# EAGLE design Pawn (EAGLE 8.3.1)
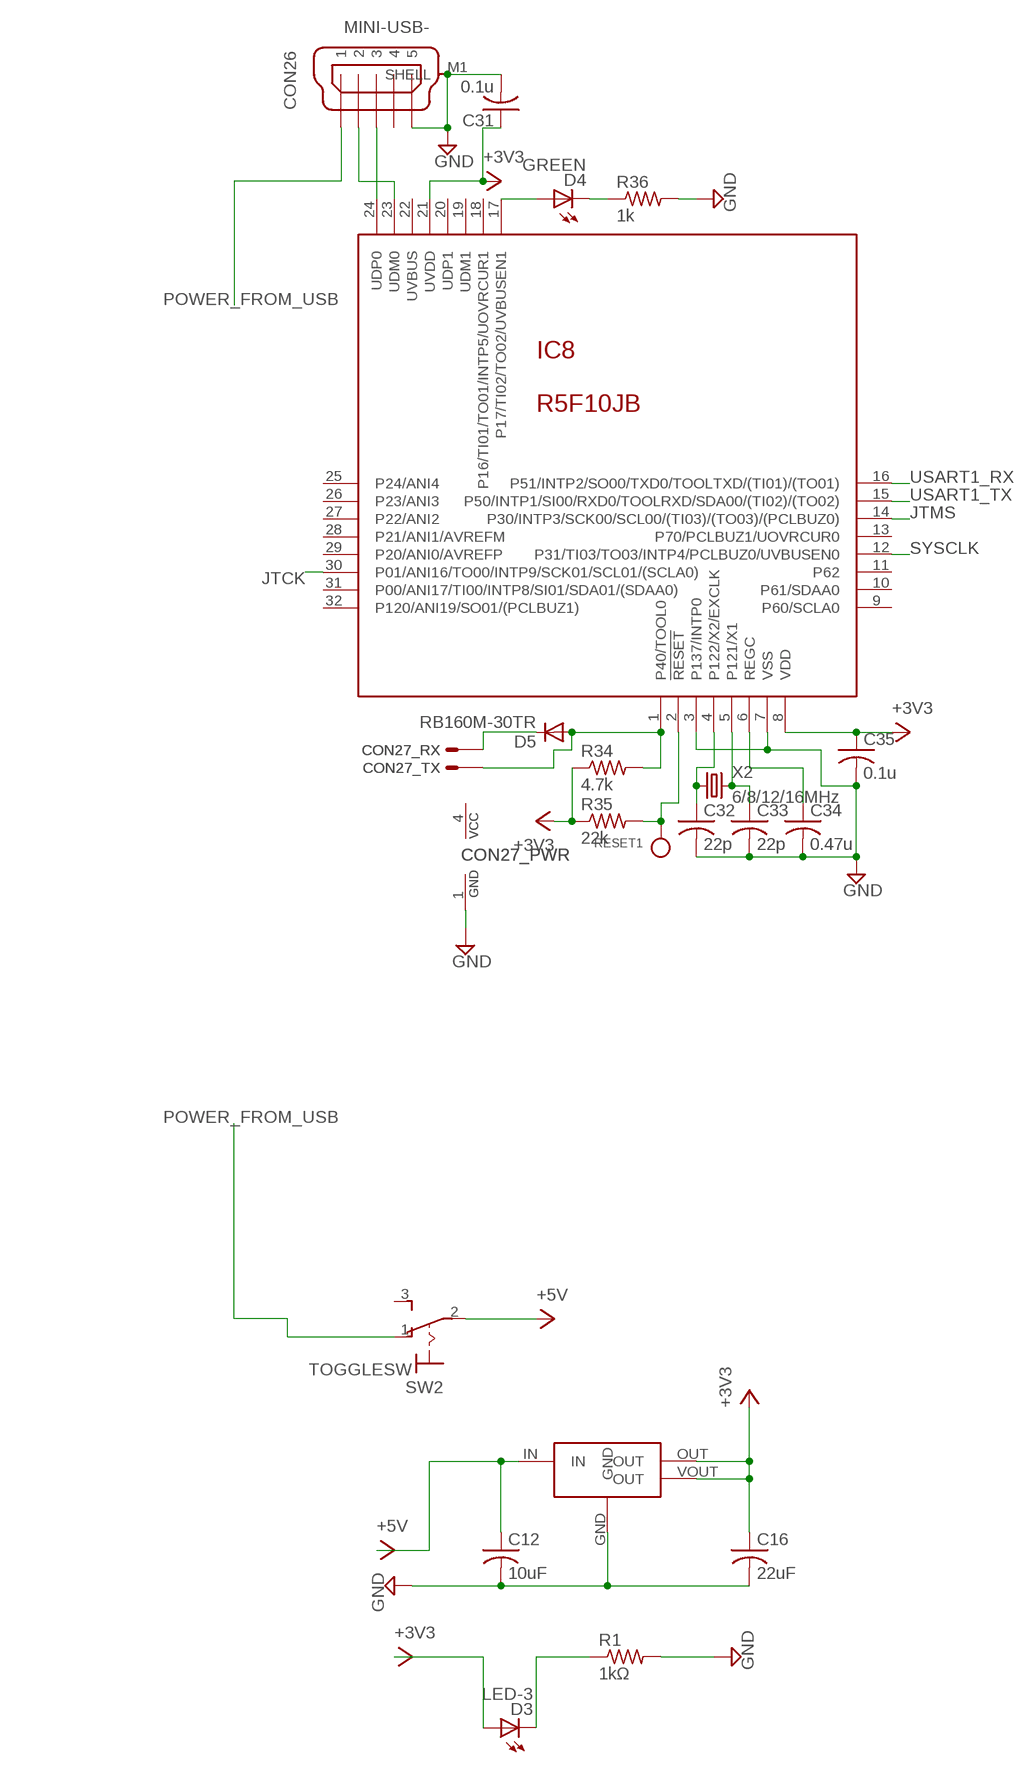
[diagram p0: schematic, sheet 1, part 1 of 2]
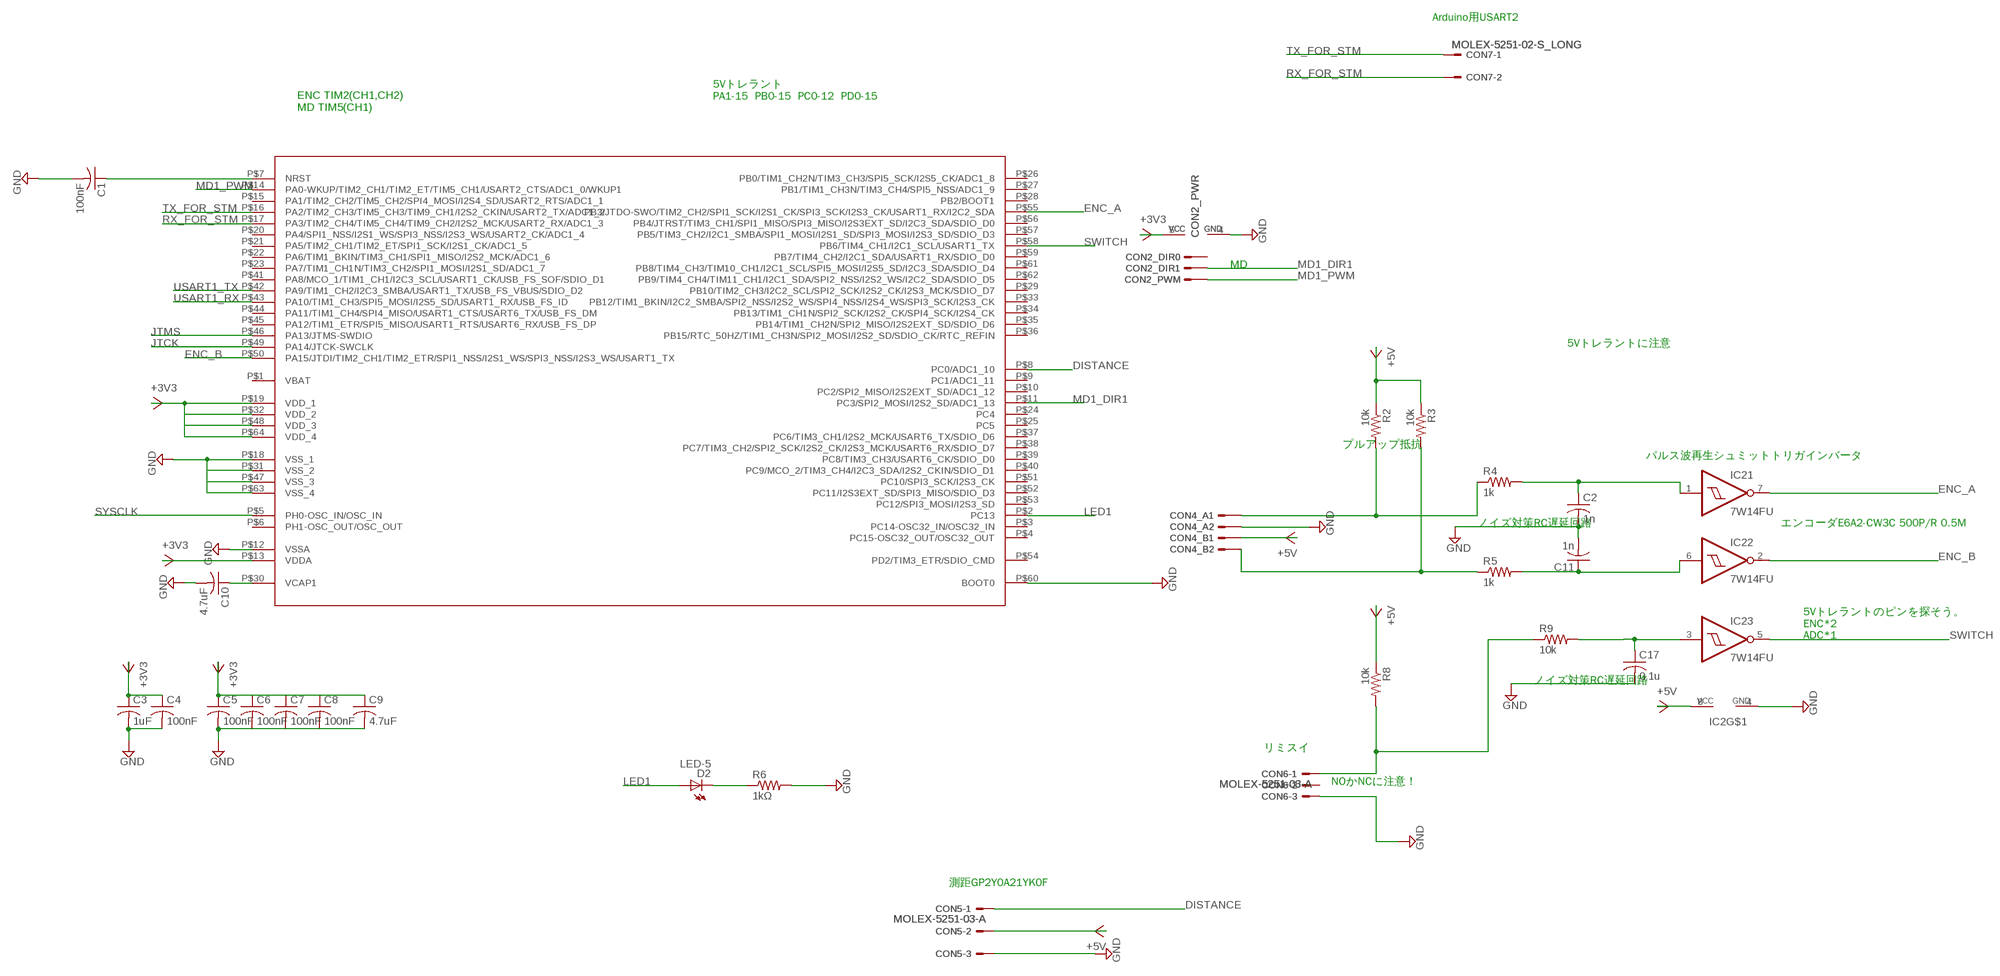
[diagram p1: schematic, sheet 1, part 2 of 2]

## Parts
C1  100nF  C-2012  [2012-C]
C2  1n  C-2012  [2012-C]
C3  1uF  C-2012  [2012-C]
C4  100nF  C-2012  [2012-C]
C5  100nF  C-2012  [2012-C]
C6  100nF  C-2012  [2012-C]
C7  100nF  C-2012  [2012-C]
C8  100nF  C-2012  [2012-C]
C9  4.7uF  C-2012  [2012-C]
C10  4.7uF  C-2012  [2012-C]
C11  1n  C-2012  [2012-C]
C12  10uF  C-2012  [2012-C]
C16  22uF  C-2012  [2012-C]
C17  0.1u  C-2012  [2012-C]
C31  0.1u  C-2012  [2012-C]
C32  22p  C-1608  [1608]
C33  22p  C-1608  [1608]
C34  0.47u  C-2012  [2012-C]
C35  0.1u  C-2012  [2012-C]
CON2  MTDRV-A  [5251-05-A]
CON4  D-3500-4  [D3500D-4-HORIZONTAL]
CON5  MOLEX-5251-03-A  [5251-03-A]
CON6  MOLEX-5251-03-A  [5251-03-A]
CON7  MOLEX-5251-02-S_LONG  [5251-02-S_LONG]
CON26  MINI-USB-  [UX60A-MB-5ST]
CON27  UART-S  [IL-G-04-S]
D2  LED-5  [LED5]
D3  LED-3  [LED3]
D4  GREEN  LED-3  [LED3]
D5  RB160M-30TR  DIODE-SMD3216  [D3216]
IC1  AZ1086H-3.3  [SOT223]
IC2  7W14FU  [MSOP8]
IC8  R5F10JB  [TQFP32-08]
R1  1kΩ  R-2012  [2012-R]
R2  10k  R-2012  [2012-R]
R3  10k  R-2012  [2012-R]
R4  1k  R-2012  [2012-R]
R5  1k  R-2012  [2012-R]
R6  1kΩ  R-2012  [2012-R]
R8  10k  R-2012  [2012-R]
R9  10k  R-2012  [2012-R]
R34  4.7k  R-2012  [2012-R]
R35  22k  R-2012  [2012-R]
R36  1k  R-2012  [2012-R]
RESET1  CHECK_PIN  [SLC-22-G]
SW2  TOGGLESW  [TOGGLESW]
U$1  STM32F411RET6  [ET-PCB-LQFP64]
X2  6/8/12/16MHz  CRYSTALHC49S  [HC49/S]

## Nets
+3V3: C3.1 C4.1 C5.1 C6.1 C7.1 C8.1 C9.1 C16.1 C31.1 C35.1 CON2.5(_PWR:VCC) D3.A IC1.OUT IC1.VOUT(OUT) IC8.8(VDD) IC8.21(UVDD) R34.1 R35.1 U$1.P$13(VDDA) U$1.P$19(VDD_1) U$1.P$32(VDD_2) U$1.P$48(VDD_3) U$1.P$64(VDD_4)
+5V: C12.1 CON4.B1 CON5.2 IC1.IN IC2.8(VCC) R2.1 R3.1 R8.1 SW2.2(P)
DISTANCE: CON5.1 U$1.P$8(PC0/ADC1_10)
ENC_A: IC2.7(1:Y) U$1.P$55(PB3/JTDO-SWO/TIM2_CH2/SPI1_SCK/I2S1_CK/SPI3_SCK/I2S3_CK/USART1_RX/I2C2_SDA)
ENC_B: IC2.2(2:Y) U$1.P$50(PA15/JTDI/TIM2_CH1/TIM2_ETR/SPI1_NSS/I2S1_WS/SPI3_NSS/I2S3_WS/USART1_TX)
GND: C1.2 C2.2 C3.2 C4.2 C5.2 C6.2 C7.2 C8.2 C9.2 C10.2 C11.2 C12.2 C16.2 C17.2 C31.2 C32.2 C33.2 C34.2 C35.2 CON2.4(_PWR:GND) CON4.A2 CON5.3 CON6.3 CON26.5 CON26.M1(SHELL) CON27.1(_PWR:GND) IC1.GND IC2.4(GND) IC8.3(P137/INTP0) IC8.7(VSS) R1.2 R6.2 R36.2 U$1.P$12(VSSA) U$1.P$18(VSS_1) U$1.P$31(VSS_2) U$1.P$47(VSS_3) U$1.P$60(BOOT0) U$1.P$63(VSS_4)
JTCK: IC8.30(P01/ANI16/TO00/INTP9/SCK01/SCL01/(SCLA0)) U$1.P$49(PA14/JTCK-SWCLK)
JTMS: IC8.14(P30/INTP3/SCK00/SCL00/(TI03)/(TO03)/(PCLBUZ0)) U$1.P$46(PA13/JTMS-SWDIO)
LED1: D2.A U$1.P$2(PC13)
MD1_DIR1: CON2.2(_DIR1:S) U$1.P$11(PC3/SPI2_MOSI/I2S2_SD/ADC1_13)
MD1_PWM: CON2.1(_PWM:S) U$1.P$14(PA0-WKUP/TIM2_CH1/TIM2_ET/TIM5_CH1/USART2_CTS/ADC1_0/WKUP1)
N$1: D2.K R6.1
N$3: C10.1 U$1.P$30(VCAP1)
N$5: CON4.A1 R2.2 R4.1
N$6: C2.1 IC2.1(1:A) R4.2
N$7: D3.K R1.1
N$8: C11.1 IC2.6(2:A) R5.2
N$9: CON4.B2 R3.2 R5.1
N$10: CON6.1 R8.2 R9.1
N$13: C17.1 IC2.3(3:A) R9.2
N$26: C1.1 U$1.P$7(NRST)
N$69: CON26.3 IC8.24(UDP0)
N$70: CON26.2 IC8.23(UDM0)
N$86: C32.1 IC8.4(P122/X2/EXCLK) X2.1
N$87: C33.1 IC8.5(P121/X1) X2.2
N$88: IC8.2(!RESET!) R35.2 RESET1.SIGNAL
N$89: C34.1 IC8.6(REGC)
N$90: CON27.3(_TX:S) D5.A IC8.1(P40/TOOL0) R34.2
N$91: CON27.2(_RX:S) D5.K(C)
N$102: D4.A IC8.17(P17/TI02/TO02/UVBUSEN1)
N$103: D4.K R36.1
POWER_FROM_USB: CON26.1 SW2.1(O)
RX_FOR_STM: CON7.2 U$1.P$17(PA3/TIM2_CH4/TIM5_CH4/TIM9_CH2/I2S2_MCK/USART2_RX/ADC1_3)
SWITCH: IC2.5(3:Y) U$1.P$58(PB6/TIM4_CH1/I2C1_SCL/USART1_TX)
SYSCLK: IC8.12(P31/TI03/TO03/INTP4/PCLBUZ0/UVBUSEN0) U$1.P$5(PH0-OSC_IN/OSC_IN)
TX_FOR_STM: CON7.1 U$1.P$16(PA2/TIM2_CH3/TIM5_CH3/TIM9_CH1/I2S2_CKIN/USART2_TX/ADC1_2)
USART1_RX: IC8.16(P51/INTP2/SO00/TXD0/TOOLTXD/(TI01)/(TO01)) U$1.P$43(PA10/TIM1_CH3/SPI5_MOSI/I2S5_SD/USART1_RX/USB_FS_ID)
USART1_TX: IC8.15(P50/INTP1/SI00/RXD0/TOOLRXD/SDA00/(TI02)/(TO02)) U$1.P$42(PA9/TIM1_CH2/I2C3_SMBA/USART1_TX/USB_FS_VBUS/SDIO_D2)
Unconnected: CON2.3(_DIR0:S) CON6.2 CON26.4 IC8.9(P60/SCLA0) IC8.10(P61/SDAA0) IC8.11(P62) IC8.13(P70/PCLBUZ1/UOVRCUR0) IC8.18(P16/TI01/TO01/INTP5/UOVRCUR1) IC8.19(UDM1) IC8.20(UDP1) IC8.22(UVBUS) IC8.25(P24/ANI4) IC8.26(P23/ANI3) IC8.27(P22/ANI2) IC8.28(P21/ANI1/AVREFM) IC8.29(P20/ANI0/AVREFP) IC8.31(P00/ANI17/TI00/INTP8/SI01/SDA01/(SDAA0)) IC8.32(P120/ANI19/SO01/(PCLBUZ1)) SW2.3(S) SW2.SHELL1(SHELL) SW2.SHELL2(SHELL) U$1.P$1(VBAT) U$1.P$3(PC14-OSC32_IN/OSC32_IN) U$1.P$4(PC15-OSC32_OUT/OSC32_OUT) U$1.P$6(PH1-OSC_OUT/OSC_OUT) U$1.P$9(PC1/ADC1_11) U$1.P$10(PC2/SPI2_MISO/I2S2EXT_SD/ADC1_12) U$1.P$15(PA1/TIM2_CH2/TIM5_CH2/SPI4_MOSI/I2S4_SD/USART2_RTS/ADC1_1) U$1.P$20(PA4/SPI1_NSS/I2S1_WS/SPI3_NSS/I2S3_WS/USART2_CK/ADC1_4) U$1.P$21(PA5/TIM2_CH1/TIM2_ET/SPI1_SCK/I2S1_CK/ADC1_5) U$1.P$22(PA6/TIM1_BKIN/TIM3_CH1/SPI1_MISO/I2S2_MCK/ADC1_6) U$1.P$23(PA7/TIM1_CH1N/TIM3_CH2/SPI1_MOSI/I2S1_SD/ADC1_7) U$1.P$24(PC4) U$1.P$25(PC5) U$1.P$26(PB0/TIM1_CH2N/TIM3_CH3/SPI5_SCK/I2S5_CK/ADC1_8) U$1.P$27(PB1/TIM1_CH3N/TIM3_CH4/SPI5_NSS/ADC1_9) U$1.P$28(PB2/BOOT1) U$1.P$29(PB10/TIM2_CH3/I2C2_SCL/SPI2_SCK/I2S2_CK/I2S3_MCK/SDIO_D7) U$1.P$33(PB12/TIM1_BKIN/I2C2_SMBA/SPI2_NSS/I2S2_WS/SPI4_NSS/I2S4_WS/SPI3_SCK/I2S3_CK) U$1.P$34(PB13/TIM1_CH1N/SPI2_SCK/I2S2_CK/SPI4_SCK/I2S4_CK) U$1.P$35(PB14/TIM1_CH2N/SPI2_MISO/I2S2EXT_SD/SDIO_D6) U$1.P$36(PB15/RTC_50HZ/TIM1_CH3N/SPI2_MOSI/I2S2_SD/SDIO_CK/RTC_REFIN) U$1.P$37(PC6/TIM3_CH1/I2S2_MCK/USART6_TX/SDIO_D6) U$1.P$38(PC7/TIM3_CH2/SPI2_SCK/I2S2_CK/I2S3_MCK/USART6_RX/SDIO_D7) U$1.P$39(PC8/TIM3_CH3/USART6_CK/SDIO_D0) U$1.P$40(PC9/MCO_2/TIM3_CH4/I2C3_SDA/I2S2_CKIN/SDIO_D1) U$1.P$41(PA8/MCO_1/TIM1_CH1/I2C3_SCL/USART1_CK/USB_FS_SOF/SDIO_D1) U$1.P$44(PA11/TIM1_CH4/SPI4_MISO/USART1_CTS/USART6_TX/USB_FS_DM) U$1.P$45(PA12/TIM1_ETR/SPI5_MISO/USART1_RTS/USART6_RX/USB_FS_DP) U$1.P$51(PC10/SPI3_SCK/I2S3_CK) U$1.P$52(PC11/I2S3EXT_SD/SPI3_MISO/SDIO_D3) U$1.P$53(PC12/SPI3_MOSI/I2S3_SD) U$1.P$54(PD2/TIM3_ETR/SDIO_CMD) U$1.P$56(PB4/JTRST/TIM3_CH1/SPI1_MISO/SPI3_MISO/I2S3EXT_SD/I2C3_SDA/SDIO_D0) U$1.P$57(PB5/TIM3_CH2/I2C1_SMBA/SPI1_MOSI/I2S1_SD/SPI3_MOSI/I2S3_SD/SDIO_D3) U$1.P$59(PB7/TIM4_CH2/I2C1_SDA/USART1_RX/SDIO_D0) U$1.P$61(PB8/TIM4_CH3/TIM10_CH1/I2C1_SCL/SPI5_MOSI/I2S5_SD/I2C3_SDA/SDIO_D4) U$1.P$62(PB9/TIM4_CH4/TIM11_CH1/I2C1_SDA/SPI2_NSS/I2S2_WS/I2C2_SDA/SDIO_D5)

## Notes on the sheet
- Arduino用USART2
- 5Vトレラント
  PA1-15  PB0-15  PC0-12  PD0-15
- ⑦
- ENC TIM2(CH1,CH2)
  MD TIM5(CH1)
- MD
- 5Vトレラントに注意
- プルアップ抵抗
- パルス波再生シュミットトリガインバータ
- ノイズ対策RC遅延回路 | エンコーダE6A2-CW3C 500P/R 0.5M
- 5Vトレラントのピンを探そう。
  ENC*2
  ADC*1
- ノイズ対策RC遅延回路
- ⑤
- リミスイ
- NOかNCに注意！
- 測距GP2Y0A21YK0F

## Power pins joined to a net without a drawn wire
VCC: CON27.4(_PWR:VCC)

## Library data of the parts
C1-C12 C16 C17 C31-C35 = Passive_Robotech:C
CON2 = Connector_Robotech:MTDRV: Robotech Motor Driver
CON4 = Connector_Robotech:D-3500-4: Tyco Dynamic Connector D-3500D-4
CON5 CON6 = Connector_Robotech:MOLEX-5251-03: CONNECTOR Molex 5251 3-pin wire to board 2.54 mm (.1 inch) pitch header
CON7 = Connector_Robotech:MOLEX-5251-02: CONNECTOR wire to board 2.54 mm (.1 inch) pitch header
CON26 = Connector_Robotech:MINI-USB-: MINI USB Connector Source: http://www.hirose.co.jp/cataloge_hp/e24000019.pdf
CON27 = Connector_Robotech:UART: Robotech Universal Asynchronous Receiver Transmitter
D2-D4 = Diode_Robotech:LED
D5 = Diode_Robotech:DIODE
IC1 = IC_Robotech:AZ1086?-*
IC2 = IC_Robotech:7W14F
IC8 = MicroControler_Robotech:R5F10JB
R1-R6 R8 R9 R34-R36 = Passive_Robotech:R
RESET1 = Connector_Robotech:CHECK_PIN
SW2 = Passive_Robotech:TOGGLESW: 3-pin Toggle Switch sold in akidzuki @ 80yen (2008/04/09)
U$1 = MicroControler_Robotech:STM32F411RET6
X2 = Passive_Robotech:CRYSTAL: CRYSTAL

## Net classes
0 default: width 0.381 mm

## Board
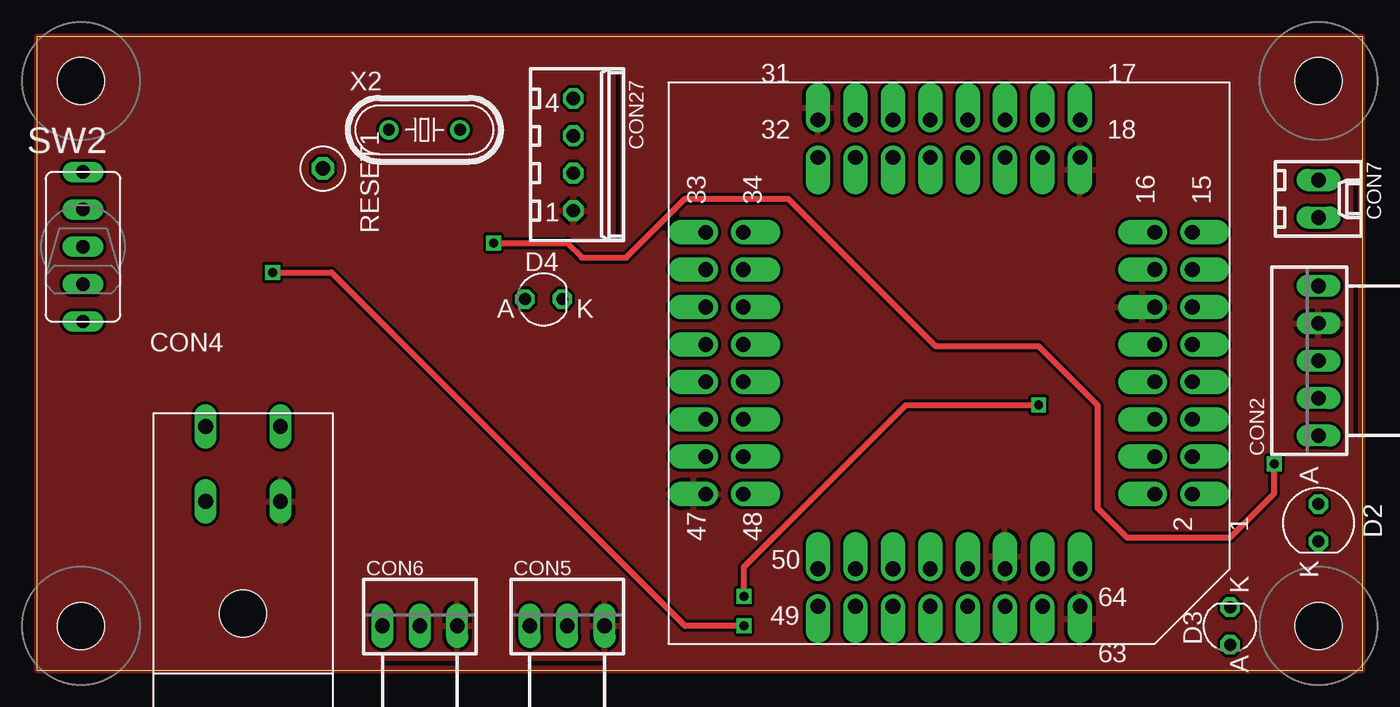
[diagram p2: board, top side]
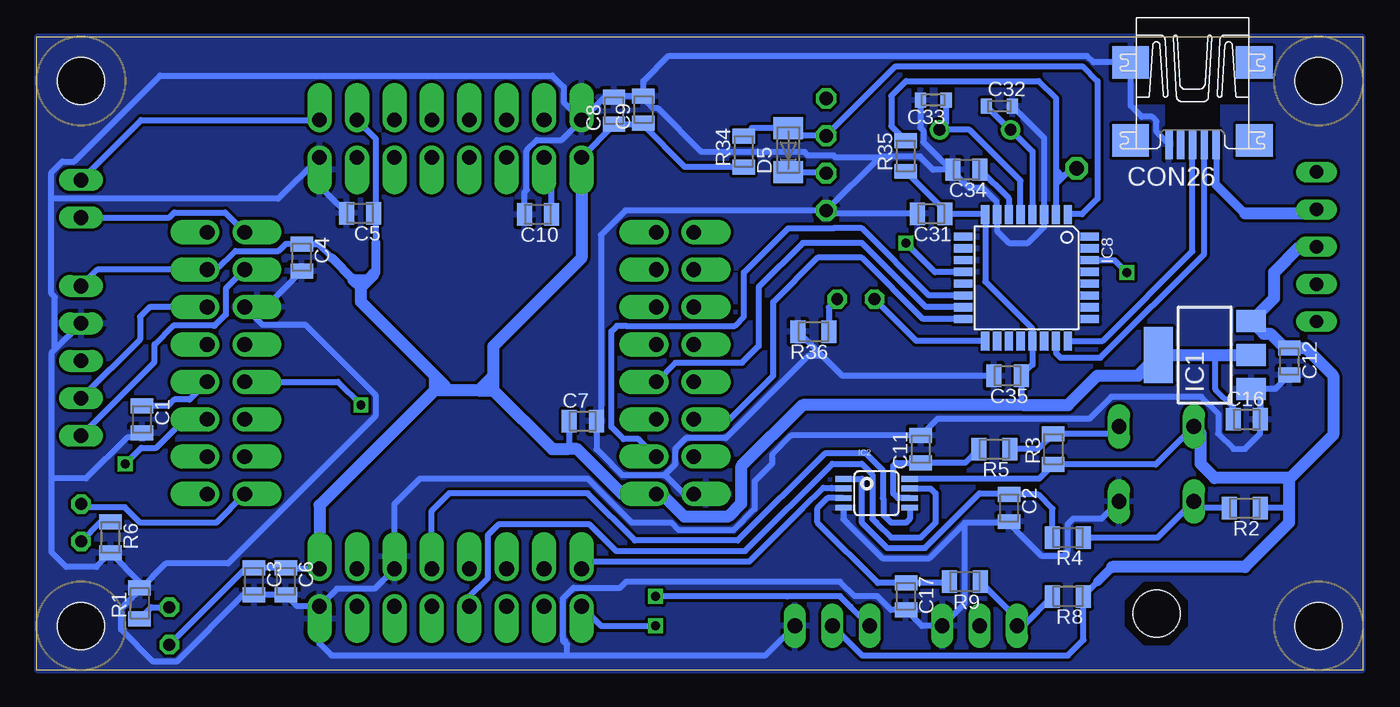
[diagram p3: board, bottom side, seen from below]

Size 90 x 43 mm. Coordinates in mm from the lower left corner, seen from the top.
Outline: 0,0 90,0 90,43 0,43 0,0
Copper layers (1*16): Top 0.0356mm / dielectric 1.5011mm / Bottom 0.0356mm
Design rules "formitaminimum": minimum track width 5mil, minimum drill 0.5994mm, track to track 0.2007mm, track to pad 0.2007mm, pad to pad 0.2007mm, via to via 0.2007mm, smd to smd 0mil, copper to edge 0mil, drill to drill 1mil, minimum pad ring 10mil, minimum via ring 8mil, stop-mask expansion 4mil, vias tented up to drill 0mil, thermal gap 10mil

### Footprints (pad centres in the part's own frame; a part is rotated, then mirrored left to right if it is on the bottom)
2012-C = smd 1.016 x 1.524: 1 -0.921,0; 2 0.921,0
1608 = smd 0.762 x 1.016: 1 -0.875,0; 2 0.875,0
5251-05-A = drill 1 long: 1 5.08,0; 2 2.54,0; 3 0,0; 4 -2.54,0; 5 -5.08,0
D3500D-4-HORIZONTAL = drill 1 long: A1 -2.54,-2.54; A2 2.54,-2.54; B1 -2.54,2.54; B2 2.54,2.54 | hole 3.2: 0,-10.16
5251-03-A = drill 1 long: 1 2.54,0; 2 0,0; 3 -2.54,0
5251-02-S_LONG = drill 1 long: 1 1.27,0; 2 -1.27,0
UX60A-MB-5ST = smd 2 x 0.5: 1 2.25,1.6; 2 2.25,0.8; 3 2.25,0; 4 2.25,-0.8; 5 2.25,-1.6 | smd 2.2 x 2.5: M1 -3.3,-4.2; M2 -3.3,4.2; M3 2,4.2; M4 2,-4.2
IL-G-04-S = drill 0.9 octagon: 1 3.81,0; 2 1.27,0; 3 -1.27,0; 4 -3.81,0
LED5 = drill 0.813 octagon: A -1.27,0; K 1.27,0
LED3 = drill 0.813 octagon: A -1.27,0; K 1.27,0
D3216 = smd 1.5 x 2: A 1.5,0; K -1.5,0
SOT223 = smd 1.5 x 2: GND -2.3,-3.15; IN 2.3,-3.15; OUT 0,-3.15 | smd 3.8 x 2: VOUT 0,3.15
MSOP8 = smd 0.4 x 1.1: 1 -0.975,-2.25; 2 -0.325,-2.25; 3 0.325,-2.25; 4 0.975,-2.25; 5 0.975,2.25; 6 0.325,2.25; 7 -0.325,2.25; 8 -0.975,2.25
TQFP32-08 = smd 1.27 x 0.559: 1 -4.293,2.8; 2 -4.293,2; 3 -4.293,1.2; 4 -4.293,0.4; 5 -4.293,-0.4; 6 -4.293,-1.2; 7 -4.293,-2; 8 -4.293,-2.8; 17 4.293,-2.8; 18 4.293,-2; 19 4.293,-1.2; 20 4.293,-0.4; 21 4.293,0.4; 22 4.293,1.2; 23 4.293,2; 24 4.293,2.8 | smd 0.559 x 1.27: 9 -2.8,-4.293; 10 -2,-4.293; 11 -1.2,-4.293; 12 -0.4,-4.293; 13 0.4,-4.293; 14 1.2,-4.293; 15 2,-4.293; 16 2.8,-4.293; 25 2.8,4.293; 26 2,4.293; 27 1.2,4.293; 28 0.4,4.293; 29 -0.4,4.293; 30 -1.2,4.293; 31 -2,4.293; 32 -2.8,4.293
2012-R = smd 1.016 x 1.524: 1 -1.048,0; 2 1.048,0
SLC-22-G = drill 1 octagon: SIGNAL 0,0
TOGGLESW = drill 0.9 long: 1 0,2.54; 2 0,0; 3 0,-2.54; SHELL1 0,5.08; SHELL2 0,-5.08
ET-PCB-LQFP64 = drill 0.998 pad 1.676 offset: P$1 -8.89,-16.51; P$2 -8.89,-13.97; P$3 -6.35,-16.51; P$4 -6.35,-13.97; P$5 -3.81,-16.51; P$6 -3.81,-13.97; P$7 -1.27,-16.51; P$8 -1.27,-13.97; P$9 1.27,-16.51; P$10 1.27,-13.97; P$11 3.81,-16.51; P$12 3.81,-13.97; P$13 6.35,-16.51; P$14 6.35,-13.97; P$15 8.89,-16.51; P$16 8.89,-13.97; P$17 16.51,-8.89; P$18 13.97,-8.89; P$19 16.51,-6.35; P$20 13.97,-6.35; P$21 16.51,-3.81; P$22 13.97,-3.81; P$23 16.51,-1.27; P$24 13.97,-1.27; P$25 16.51,1.27; P$26 13.97,1.27; P$27 16.51,3.81; P$28 13.97,3.81; P$29 16.51,6.35; P$30 13.97,6.35; P$31 16.51,8.89; P$32 13.97,8.89; P$33 8.89,16.51; P$34 8.89,13.97; P$35 6.35,16.51; P$36 6.35,13.97; P$37 3.81,16.51; P$38 3.81,13.97; P$39 1.27,16.51; P$40 1.27,13.97; P$41 -1.27,16.51; P$42 -1.27,13.97; P$43 -3.81,16.51; P$44 -3.81,13.97; P$45 -6.35,16.51; P$46 -6.35,13.97; P$47 -8.89,16.51; P$48 -8.89,13.97; P$49 -16.51,8.89; P$50 -13.97,8.89; P$51 -16.51,6.35; P$52 -13.97,6.35; P$53 -16.51,3.81; P$54 -13.97,3.81; P$55 -16.51,1.27; P$56 -13.97,1.27; P$57 -16.51,-1.27; P$58 -13.97,-1.27; P$59 -16.51,-3.81; P$60 -13.97,-3.81; P$61 -16.51,-6.35; P$62 -13.97,-6.35; P$63 -16.51,-8.89; P$64 -13.97,-8.89
HOLE_3.2 = hole 3.2: 0,0
HC49/S = drill 0.813: 1 -2.413,0; 2 2.413,0

### Placement (x,y rotation side)
C1  82.86,17.02 270 bottom
C2  24,11 270 bottom
C3  75.26,6.02 270 bottom
C4  72.02,28.02 270 bottom
C5  68.06,31.02 180 bottom
C6  73.1,6.02 270 bottom
C7  52.94,16.9 0 bottom
C8  50.82,37.98 90 bottom
C9  48.82,38.06 90 bottom
C10  55.98,30.94 180 bottom
C11  30,15 90 bottom
C12  4.98,20.95 270 bottom
C16  7.87,17.02 0 bottom
C17  31,5 270 bottom
C31  29.29,30.98 180 bottom
C32  24.66,38.29 0 bottom
C33  29.15,38.71 180 bottom
C34  26.89,33.98 180 bottom
C35  24.1,19.98 180 bottom
CON2  87,21 270 top
CON4  14,14 0 top
CON5  36,3 180 top
CON6  26,3 180 top
CON7  87,32 270 top
CON26  11.55,37.96 270 bottom
CON27  36.42,35.01 270 top
D2  87,10 270 top
D3  81,3 90 top
D4  34.4,25.18 0 top
D5  38.99,35.31 90 bottom
IC1  10.72,21.39 90 bottom
IC2  33,12 270 bottom
IC8  22.82,26.64 270 bottom
R1  83.02,4.53 90 bottom
R2  8,11 180 bottom
R3  21,15 90 bottom
R4  20,9 180 bottom
R5  25,15 180 bottom
R6  85,9 270 bottom
R8  20,5 180 bottom
R9  27,6 180 bottom
R34  42.02,35.21 90 bottom
R35  31.02,34.91 90 bottom
R36  37.28,22.98 180 bottom
RESET1  19.42,34.06 270 top
SW2  3.13,28.74 0 top
U$1  61.92,20.84 90 top
U$2  [HOLE_3.2]  3,3 0 top
U$3  [HOLE_3.2]  87,3 0 top
U$4  [HOLE_3.2]  87,40 0 top
U$5  [HOLE_3.2]  3,40 0 top
X2  26.31,36.69 0 top

### Tracks (layer width: path | path; a pad name or v marks a point on that pad's centre or on a via)
+3V3
  Bottom 0.406: CON2.5 85.89,27.19 U$1.P$13 77.79,27.19 76.52,28.46 73.59,28.46 73.52,28.52 73.11,28.94 C4.1 70.94,28.94 70,28 | U$1.P$64 73.03,6.87 C6.1 C3.1 75.79,6.94 D3.A | U$1.P$19 67,36.08 67,31.16 C5.1 67,30.88 67,29 | 48.9,37.06 C8.1 50.82,37.02 U$1.P$32 | 48.9,37.06 C9.1 | R34.1 46,34.16 48.9,37.06 | R35.1 28.37,31.21 C31.1 25.67,30.98 IC8.8 25.62,26.37 22.44,23.19 22.44,22.36 IC8.21 22.42,20.74 C35.1 23.18,18.18 23,18 | C16.1 8.79,17.85 10,19.06 10,21.39 | C7.1 53.86,15.14 54,15
  Bottom 0.61: 70,28 68.5,26.5 | 67,29 67,27 67.14,26.86
  Bottom 0.813: IC1.OUT 10,21.39 IC1.VOUT 15.26,20 18,20 20,18 23,18 38,18 42.19,13.81 42.19,11.31 43.09,10.4 46.05,10.4 47.59,11.95 U$1.P$48 50.27,11.95 53.32,15 54,15 55,15 59,19 | 68,26 68,25 63,20 | 68,26 68.5,26.5 67.5,26.5 | 62.5,19.5 63,20 | U$1.P$32 53.03,27.97 59,22 59,20 | 62.5,19.5 63,19 | 63,19 70.81,11.19 U$1.P$64 | 62,19 63,19 | 67.14,26.86 67.5,26.5 | 67.5,26.5 68,26 | 60,19 59,19 | 59,19 59,20 | 60,19 62,19 | 62,19 62.5,19.5 | 59,20 60,19 | 63,20 63,19
+5V
  Bottom 0.406: CON5.2 33.99,0.99 22.94,0.99 22.93,1 20,1 18.95,2.05 R8.1 | CON4.B1 14.05,13.95 R3.1 | 21.05,14 R3.1 | IC2.8 30.73,13 21.95,13 R3.1 | 5,11 R2.1 | 18,6 18.95,5.05
  Bottom 0.61: 17,7 18,6
  Bottom 0.813: SW2.2 4.26,28.74 6,27 6,25.26 IC1.IN 6.73,22.85 6.28,22.85 5.3,21.87 C12.1 3.87,21.87 2,20 2,15.95 5,12.95 | R2.1 7,10.95 | 17,7 8,7 5,10 5,11 5,12.95 | 18.95,5.05 R8.1 | CON4.B1 11,16.08 11,14 10.04,13.04 5.09,13.04 5,12.95
DISTANCE  (via drill 0.6)
  Top 0.406: v48,5 48,7 59,18 v68,18
  Bottom 0.406: CON5.1 34.77,4.3 35.48,5.01 39.06,5.01 39.07,5 v48,5 | U$1.P$8 69.57,19.57 v68,18
ENC_A
  Bottom 0.406: IC2.7 29.32,12.32 29,12 29,10 30,9 32,9 33,10 33.28,10.28 33.28,13.28 34,14 36,14 | 36,14 | 36,14 41.92,8.08 50.67,8.08 52.47,9.89 58.67,9.89 59.38,9.17 59.38,6.24 60.65,4.97 U$1.P$55
ENC_B
  Bottom 0.406: IC2.2 36,12.32 36.06,12.38 36.62,12.38 38,11 41.62,7.38 52.52,7.38 U$1.P$50
GND
  Bottom 0.406: U$1.P$63 72.33,4.33 C6.2 C3.2 75.98,5.1 80.52,0.57 82.09,0.57 84.28,2.77 84.28,4.2 83.02,5.46 | U$1.P$63 69.62,5.52 67.08,5.52 U$1.P$60 65.73,11.27 64,13 52.61,13 49.61,10 46.93,10 46.43,9.5 42.72,9.5 41.28,10.93 41.28,12.81 40.09,14 40.09,14.62 38.79,15.92 C11.2 28.86,17.06 18.55,17.06 17.06,18.55 10.94,18.55 9.8,17.41 9.8,16.05 8.75,15 8,15 6.95,16.05 C16.2 6.95,18.47 IC1.GND 5.92,19.09 C12.2 | C5.2 70.81,32.85 U$1.P$18 73.62,32 89.01,32 | C4.2 74.47,24.65 U$1.P$12 74.69,23.45 71.78,23.45 67.02,18.69 67.02,17.25 77.03,7.24 81.24,7.24 83.02,5.46 | C10.2 56.9,32.45 56.75,32.6 56.75,35.3 56.06,35.99 54.39,35.99 U$1.P$31 | U$1.P$31 51.48,38.9 C8.2 50.74,38.98 49,38.98 | 49,38.98 C9.2 48.82,40 47.11,41.71 18.71,41.71 18.26,41.26 CON26.M1 15.75,38.31 15,37.56 14.29,37.56 14,37.27 14,36.56 CON26.5 | 27.81,33.84 26.69,32.72 25.78,32.72 24.84,31.78 24.84,30.95 IC8.7 24.82,29.82 24,29 22.73,29 21.64,30.09 21.64,30.91 | 27.81,33.84 C34.2 29.16,33.98 30.05,34.87 32.75,34.87 32.81,34.81 | IC8.3 21.64,30.91 | C33.2 30.02,36.84 29.83,36.64 29.83,35.86 27.81,33.84 | C32.2 21.64,36.14 21.64,30.91 | IC2.4 35.25,10.25 35,10 32.59,7.59 29.41,7.59 27,10 | CON4.A2 17.73,10.27 19.67,10.27 20.04,9.9 20.04,8.03 20.33,7.74 21.76,7.74 24,9.97 C2.2 24.08,10 27,10 | 27,10 27,4.54 CON6.3 29.92,3 C17.2 32.01,4.08 32.94,5.01 34.48,5.01 35.47,6 50,6 50.41,5.59 53.55,5.59 54.3,4.85 54.3,2.13 54.14,1.97 54.14,1.86 | U$1.P$47 46.05,11.95 47.32,13.22 47.43,13.22 | 83.02,5.46 R1.2 83.02,5.97 R6.2 85.95,7 88,7 89,8 89,13 | U$1.P$63 70.81,1.81 70,1 54,1 | 54,1 40.54,1 CON5.3
  Bottom 0.406: 54,1 54,1.73 54.14,1.86 | 54.14,1.86 54.3,2.03 | 47.43,13.22 50.25,13.22 50.97,13.93 50.97,13.95 52.02,15 C7.2 51.71,17.21 51.71,29.55 50.05,31.2 CON27.1 | 32.81,34.81 CON27.1 | C31.2 36.2,30.98 CON27.1 | C35.2 35.33,19.98 36.67,21.33 | 36.67,21.33 R36.2 | 47.43,13.22 46.67,13.98 46.67,15.01 45.93,15.76 43.22,15.76 37.65,21.33 36.67,21.33 | 32.81,34.81 35.78,34.81 35.92,34.95 37.67,34.95 37.89,35.17 44.87,35.17 47.85,38.15 48.17,38.15 49,38.98 | 89,13 89,15.39 89.01,15.4 89.01,21.53 88.77,21.77 | CON2.4 88.77,21.77 | 88.77,21.77 88.77,25.32 89.01,25.56 89.01,32 | 89.01,32 89.01,33.79 88.28,34.53 87.47,34.53 81.63,40.37 55.01,40.37 54.23,39.58 54.23,38.55 U$1.P$31 | C1.2 83.17,15.79 83.87,15.79 86.67,13 89,13
  pour Bottom: 0,43 90,43 90,0 0,0
  pour Top: 0,43 0,0 90,0 90,43
JTCK  (via drill 0.6)
  Top 0.406: v16,27 20,27 31.5,15.5 44,3 v48,3
  Bottom 0.406: IC8.30 16.84,27.84 v16,27 | U$1.P$49 51.7,3 v48,3
JTMS
  Bottom 0.406: IC8.14 29.44,25.44 34,30 35.91,30 35.92,29.99 39.01,29.99 42,27 42,24 42.62,23.38 50,23.38 50.62,23.38 51,23 51,16.51 50.18,15.69 49.15,15.69 U$1.P$46
LED1
  Bottom 0.406: U$1.P$2 77.84,10 82.97,10 84.03,11.06 86.79,11.06 D2.A
MD1_DIR1
  Bottom 0.406: CON2.2 83,22.46 83,24 82.35,24.65 U$1.P$11
MD1_PWM
  Bottom 0.406: CON2.1 82,20.92 82,22.11 80.73,23.38 78,23.38 77.91,23.38 77.17,24.13 77.17,25.91 U$1.P$14
N$1
  Bottom 0.406: D2.K 85.68,10.05 R6.1
N$3
  Bottom 0.406: C10.1 55.06,34.3 U$1.P$30
N$5
  Bottom 0.406: R4.1 13.92,9 CON4.A1 11,11 R2.2
N$6
  Bottom 0.406: R4.2 21.05,10.95 22.02,11.92 C2.1 24.08,12 26,12 29.71,8.29 32.29,8.29 33.99,9.99 33.99,12.99 | 33.99,12.99 34,13 | IC2.1 34,12.97 33.99,12.99
N$7
  Bottom 0.406: R1.1 82.23,4.27 D3.K
N$8
  Bottom 0.406: 31,11.68 IC2.6 31.56,11.68 31.87,11.98 31.87,13.87 31.66,14.08 C11.1 26.97,14.08 R5.2
N$9
  Bottom 0.406: CON4.B2 17.03,16.05 R3.2 | R3.2 21.05,16 | R3.2 22.05,15 R5.1
N$10
  Bottom 0.406: R8.2 23.05,3 CON6.1 23.46,3.51 R9.1
N$13
  Bottom 0.406: IC2.3 36.33,11.68 37,11 37,10 32.92,5.92 C17.1 28.13,5.92 R9.2
N$26
  Bottom 0.406: U$1.P$7 79.63,18.37 80.66,18.37 81.09,17.94 C1.1
N$69
  Bottom 0.406: IC8.24 17.65,22.35 11.55,28.45 CON26.3
N$70
  Bottom 0.406: IC8.23 20.8,22.33 20.8,21.5 20.51,21.21 17.79,21.21 10.75,28.25 CON26.2
N$86
  Bottom 0.406: IC8.4 22.42,35.21 X2.1 23.94,36.69 C32.1
N$87
  Bottom 0.406: IC8.5 23.22,33.22 24,34 26.69,36.69 X2.2 28.27,37.14 C33.1
N$88
  Bottom 0.406: 20.82,34 20.82,38.82 22,40 31,40 32,39 32,36.94 R35.2 | 20.82,34 20.82,33 | 20.82,33 IC8.2 | RESET1.SIGNAL 19.76,34.06 20.41,33.41 | 20.41,33.41 20.82,33 | 20.82,34 20.41,33.59 20.41,33.41
N$89
  Bottom 0.406: C34.1 24.02,32.03 IC8.6
N$90
  Bottom 0.406: IC8.1 20.04,30.95 19.05,30.95 18,32 18,40 19,41 31.7,41 CON27.3 38.46,36.28 D5.A 41.47,36.81 R34.2
N$91
  Bottom 0.406: D5.K 36.49,33.81 CON27.2
N$102
  Bottom 0.406: IC8.17 30.3,22.35 D4.A
N$103
  Bottom 0.406: D4.K 36.23,24.62 R36.1
POWER_FROM_USB
  Bottom 0.406: CON26.1 9.95,34 9.95,32.95 9.94,32.94
  Bottom 0.61: 9.94,32.95 9.94,32.94 8,31
  Bottom 0.813: 8,31 3.41,31 SW2.1
RX_FOR_STM
  Bottom 0.406: CON7.2 82.92,37.35 U$1.P$17
SWITCH
  Bottom 0.406: IC2.5 30.75,10.25 31,10 32,10 32.5,10.5 32.5,11.61 32.57,11.69 32.57,13.57 33.71,14.71 36.51,14.71 42.42,8.79 49.4,8.79 52.6,12 62,12 63.19,10.81 U$1.P$58
SYSCLK  (via drill 0.6)
  Top 0.406: v31,29 36,29 37,28 40,28 44,32 51,32 61,22 68,22 72,18 72,11 74,9 81,9 84,12 v84,14
  Bottom 0.406: IC8.12 27.13,27.02 29.02,27.02 v31,29 | v84,14 82.91,15.09 81.89,15.09 79.95,17.03 U$1.P$5
TX_FOR_STM
  Bottom 0.406: CON7.1 81,30.73 80.66,31.07 77.23,31.07 U$1.P$16
USART1_RX
  Bottom 0.406: IC8.16 29.84,23.84 34,28 37,28 40,25 40,20 42.97,17.03 U$1.P$43
USART1_TX
  Bottom 0.406: IC8.15 27.13,24.66 29.66,24.66 34,29 38,29 41,26 41,22 42.13,20.87 46.65,20.87 U$1.P$42